# EAGLE design ArduinoInterface (EAGLE 8.3.1)
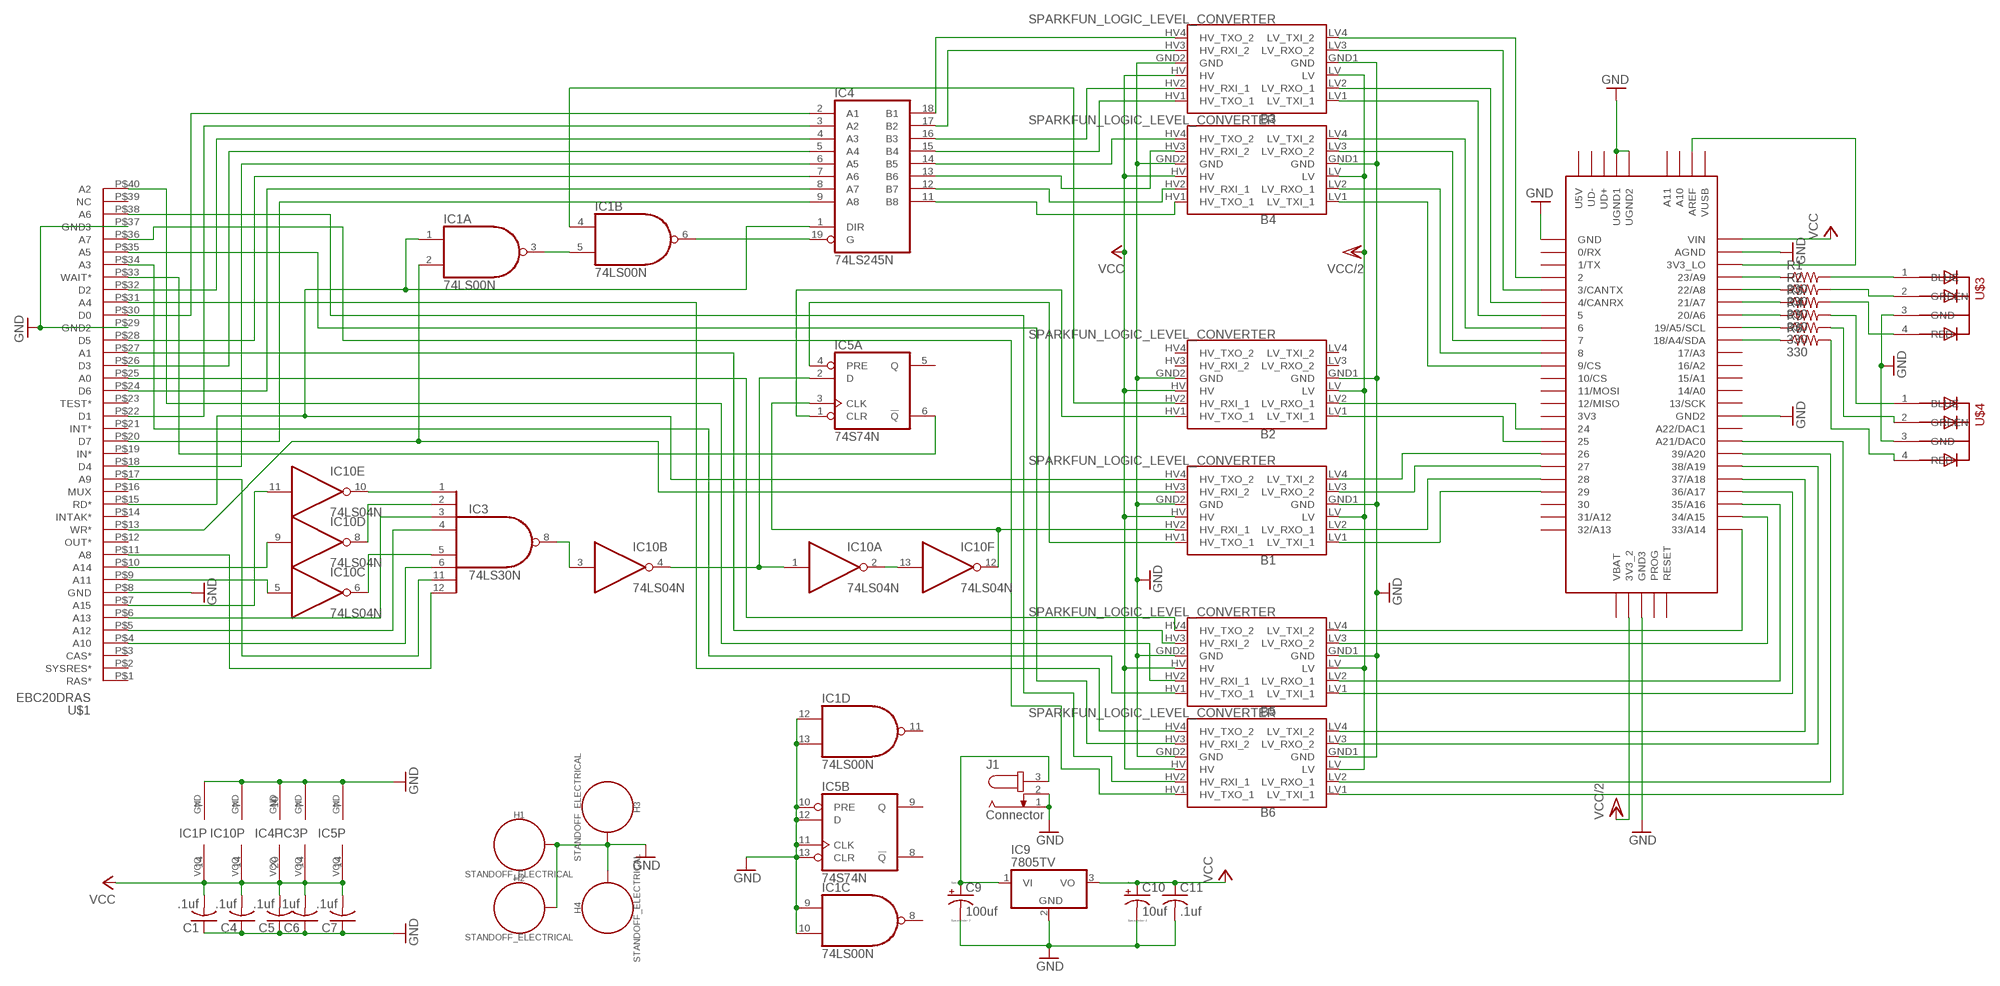
[diagram p0: schematic, sheet 1]

## Parts
B1  SPARKFUN_LOGIC_LEVEL_CONVERTER  [SPARKFUN_LOGIC_LEVEL_CONVERTER]
B2  SPARKFUN_LOGIC_LEVEL_CONVERTER  [SPARKFUN_LOGIC_LEVEL_CONVERTER]
B3  SPARKFUN_LOGIC_LEVEL_CONVERTER  [SPARKFUN_LOGIC_LEVEL_CONVERTER]
B4  SPARKFUN_LOGIC_LEVEL_CONVERTER  [SPARKFUN_LOGIC_LEVEL_CONVERTER]
B5  SPARKFUN_LOGIC_LEVEL_CONVERTER  [SPARKFUN_LOGIC_LEVEL_CONVERTER]
B6  SPARKFUN_LOGIC_LEVEL_CONVERTER  [SPARKFUN_LOGIC_LEVEL_CONVERTER]
C1  .1uf  C-US025-025X050  [C025-025X050]
C4  .1uf  C-US025-025X050  [C025-025X050]
C5  .1uf  C-US025-025X050  [C025-025X050]
C6  .1uf  C-US025-025X050  [C025-025X050]
C7  .1uf  C-US025-025X050  [C025-025X050]
C9  100uf  CPOL-USE5-6  [E5-6]
C10  10uf  CPOL-USE5-6  [E5-6]
C11  .1uf  C-US025-025X050  [C025-025X050]
H1  STANDOFF_ELECTRICAL  [STANDOFF-ELECTRICAL]
H2  STANDOFF_ELECTRICAL  [STANDOFF-ELECTRICAL]
H3  STANDOFF_ELECTRICAL  [STANDOFF-ELECTRICAL]
H4  STANDOFF_ELECTRICAL  [STANDOFF-ELECTRICAL]
IC1  74LS00N  [DIL14]
IC3  74LS30N  [DIL14]
IC4  74LS245N  [DIL20]
IC5  74S74N  [DIL14]
IC9  7805TV  [TO220V]
IC10  74LS04N  [DIL14]
J1  Connector  JACK-PLUG0  [SPC4077]
R1  330  R-US_0204/2V  [0204V]
R2  330  R-US_0204/2V  [0204V]
R3  330  R-US_0204/2V  [0204V]
R4  330  R-US_0204/2V  [0204V]
R5  330  R-US_0204/2V  [0204V]
R6  330  R-US_0204/2V  [0204V]
U$1  EBC20DRAS  [EBC20DRAS]
U$2  TEENSY_3.5/3.6  [TEENSY_3.5/3.6]
U$3  5MMRGBLED  [LED5MMRGB]
U$4  5MMRGBLED  [LED5MMRGB]

## Nets
37XX: IC5.2(A:D) IC10.1(A:I) IC10.4(B:O)
37XX_: IC3.8(O) IC10.3(B:I)
A0: B5.HV4(HV_TXO_2) U$1.P$25(A0)
A0_LV: B5.LV4(LV_TXI_2) U$2.33/A14
A1: B5.HV3(HV_RXI_2) U$1.P$27(A1)
A1_LV: B5.LV3(LV_RXO_2) U$2.34/A15
A2: B5.HV2(HV_RXI_1) U$1.P$40(A2)
A2_LV: B5.LV2(LV_RXO_1) U$2.35/A16
A3: B5.HV1(HV_TXO_1) U$1.P$34(A3)
A3_LV: B5.LV1(LV_TXI_1) U$2.36/A17
A4: B6.HV4(HV_TXO_2) U$1.P$31(A4)
A4_LV: B6.LV4(LV_TXI_2) U$2.37/A18
A5: B6.HV3(HV_RXI_2) U$1.P$35(A5)
A5_LV: B6.LV3(LV_RXO_2) U$2.38/A19
A6: B6.HV2(HV_RXI_1) U$1.P$38(A6)
A6_LV: B6.LV2(LV_RXO_1) U$2.39/A20
A7: B6.HV1(HV_TXO_1) U$1.P$36(A7)
A7_LV: B6.LV1(LV_TXI_1) U$2.21/DAC0(A21/DAC0)
A8: IC3.12(I7) U$1.P$11(A8)
A9: IC3.11(I6) U$1.P$17(A9)
A10: IC3.6(I5) U$1.P$4(A10)
A11: IC10.5(C:I) U$1.P$9(A11)
A12: IC3.4(I3) U$1.P$5(A12)
A13: IC3.3(I2) U$1.P$6(A13)
A15: IC10.11(E:I) U$1.P$7(A15)
D0: IC4.2(A1) U$1.P$30(D0)
D0_HV: B3.HV4(HV_TXO_2) IC4.18(B1)
D0_LV: B3.LV4(LV_TXI_2) U$2.2
D1: IC4.3(A2) U$1.P$22(D1)
D1_HV: B3.HV3(HV_RXI_2) IC4.17(B2)
D1_LV: B3.LV3(LV_RXO_2) U$2.3/CANTX
D2: IC4.4(A3) U$1.P$32(D2)
D2_HV: B3.HV2(HV_RXI_1) IC4.16(B3)
D2_LV: B3.LV2(LV_RXO_1) U$2.4/CANRX
D3: IC4.5(A4) U$1.P$26(D3)
D3_HV: B3.HV1(HV_TXO_1) IC4.15(B4)
D3_LV: B3.LV1(LV_TXI_1) U$2.5
D4: IC4.6(A5) U$1.P$18(D4)
D4_HV: B4.HV4(HV_TXO_2) IC4.14(B5)
D4_LV: B4.LV4(LV_TXI_2) U$2.6
D5: IC4.7(A6) U$1.P$28(D5)
D5_HV: B4.HV3(HV_RXI_2) IC4.13(B6)
D5_LV: B4.LV3(LV_RXO_2) U$2.7
D6: IC4.8(A7) U$1.P$24(D6)
D6_HV: B4.HV2(HV_RXI_1) IC4.12(B7)
D6_LV: B4.LV2(LV_RXO_1) U$2.8
D7: IC4.9(A8) U$1.P$20(D7)
D7_HV: B4.HV1(HV_TXO_1) IC4.11(B8)
D7_LV: B4.LV1(LV_TXI_1) U$2.9/CS
DATA_BUS_ENABLE: B2.HV2(HV_RXI_1) IC1.4(B:I0)
DATA_BUS_ENABLE_LV: B2.LV2(LV_RXO_1) U$2.24
FLIPFLOP_CLR: B2.HV1(HV_TXO_1) IC5.1(A:CLR)
FLIPFLOP_CLR_LV: B2.LV1(LV_TXI_1) U$2.25
FLIPFLOP_PRE: B1.HV1(HV_TXO_1) IC5.4(A:PRE)
FLIPFLOP_PRE_LV: B1.LV1(LV_TXI_1) U$2.29
GND: B1.GND1(GND) B1.GND2(GND) B2.GND1(GND) B2.GND2(GND) B3.GND1(GND) B3.GND2(GND) B4.GND1(GND) B4.GND2(GND) B5.GND1(GND) B5.GND2(GND) B6.GND1(GND) B6.GND2(GND) C1.1 C4.1 C5.1 C6.1 C7.1 C9.- C10.- C11.2 H1.P1 H2.P1 H3.P1 H4.P1 IC1.7(P:GND) IC1.9(C:I0) IC1.10(C:I1) IC1.12(D:I0) IC1.13(D:I1) IC3.7(GND) IC4.10(GND) IC5.7(P:GND) IC5.10(B:PRE) IC5.11(B:CLK) IC5.12(B:D) IC5.13(B:CLR) IC9.2(GND) IC10.7(P:GND) J1.1 J1.2 U$1.P$8(GND) U$1.P$29(GND2) U$1.P$37(GND3) U$2.AGND U$2.GND U$2.GND2 U$2.GND3 U$2.UGND1 U$2.UGND2 U$3.3(GND) U$4.3(GND)
INTERRUPT: B1.HV2(HV_RXI_1) IC5.3(A:CLK) IC10.12(F:O)
INTERRUPT_LV: B1.LV2(LV_RXO_1) U$2.28
N$1: U$2.3V3_LO U$2.AREF
N$2: IC10.9(D:I) U$1.P$10(A14)
N$3: IC3.1(I0) IC10.10(E:O)
N$4: IC3.2(I1) IC10.8(D:O)
N$5: R1.1 U$2.23/A9
N$6: R2.1 U$2.22/A8
N$7: IC10.2(A:O) IC10.13(F:I)
N$8: IC3.5(I4) IC10.6(C:O)
N$9: R3.1 U$2.21/A7
N$10: R1.2 U$3.1(BLUE)
N$11: IC1.6(B:O) IC4.19(G)
N$12: C9.+ IC9.1(VI) J1.3
N$13: IC1.3(A:O) IC1.5(B:I1)
N$14: R2.2 U$3.2(GREEN)
N$15: R3.2 U$3.4(RED)
N$16: R4.1 U$2.20/A6
N$17: R5.1 U$2.19/A5/SCL
N$18: R6.1 U$2.18/A4/SDA
N$19: R4.2 U$4.1(BLUE)
N$20: R5.2 U$4.2(GREEN)
N$21: R6.2 U$4.4(RED)
RD_: B1.HV4(HV_TXO_2) IC1.1(A:I0) IC4.1(DIR) U$1.P$15(RD*)
RD_LV_: B1.LV4(LV_TXI_2) U$2.26
VCC: B1.HV B2.HV B3.HV B4.HV B5.HV B6.HV C1.2 C4.2 C5.2 C6.2 C7.2 C10.+ C11.1 IC1.14(P:VCC) IC3.14(VCC) IC4.20(VCC) IC5.14(P:VCC) IC9.3(VO) IC10.14(P:VCC) U$2.VIN
VCC/2: B1.LV B2.LV B3.LV B4.LV B5.LV B6.LV U$2.3V3_2
WAIT_: IC5.6(A:!Q) U$1.P$33(WAIT*)
WR_: B1.HV3(HV_RXI_2) IC1.2(A:I1) U$1.P$13(WR*)
WR_LV_: B1.LV3(LV_RXO_2) U$2.27
Unconnected: B2.HV3(HV_RXI_2) B2.HV4(HV_TXO_2) B2.LV3(LV_RXO_2) B2.LV4(LV_TXI_2) IC1.8(C:O) IC1.11(D:O) IC5.5(A:Q) IC5.8(B:!Q) IC5.9(B:Q) U$1.P$1(RAS*) U$1.P$2(SYSRES*) U$1.P$3(CAS*) U$1.P$12(OUT*) U$1.P$14(INTAK*) U$1.P$16(MUX) U$1.P$19(IN*) U$1.P$21(INT*) U$1.P$23(TEST*) U$1.P$39(NC) U$2.0/RX U$2.1/TX U$2.3V3 U$2.10/CS U$2.11/MOSI U$2.12/MISO U$2.13/SCK U$2.14/A0 U$2.15/A1 U$2.16/A2 U$2.17/A3 U$2.30 U$2.31/A12 U$2.32/A13 U$2.A10 U$2.A11 U$2.A22/DAC1 U$2.PROG U$2.RESET U$2.U5V U$2.UD+ U$2.UD- U$2.VBAT U$2.VUSB

## Library data of the parts
B1-B6 = SparkFun-Boards:SPARKFUN_LOGIC_LEVEL_CONVERTER: SparkFun Logic Level Converter -Bi-Directional This is the mechnical outline for the 3.3V - 5V bi directional logic level converter. *Note, the "LOCK" Package has the header pins staggered by an offset of 5 mils (off center line), so that when you slide a row of standard 0.1" headers into the PTH pads, it will hold position vertically. See the follwing turorial for more information on this type of special footprints: Sneaky Footprints <https://www.sparkfun.com/tutorials/114> SparkFun Products: SparkFun Logic Level Converter - Bi-Directional <https://www.sparkfun.com/products/12009>
C1 C4-C7 C11 = adafruit:C-US: CAPACITOR, American symbol
C9 C10 = resistor:CPOL-US: POLARIZED CAPACITOR, American symbol
H1-H4 = SparkFun-Hardware:STANDOFF_ELECTRICAL: Stand Off Drill holes with an electrical connection. For example, use these to ground your board to a chassis. Example SparkFun Products Screw - Phillips Head (1/4", 4-40, 10 pack) <https://www.sparkfun.com/products/10453> (PRT-10453) Screw - Phillips Head (1/2", 4-40, 10 pack) <https://www.sparkfun.com/products/10452> (PRT-10452) Screw - Phillips Head (3/4", 4-40, 10 pack) <https://www.sparkfun.com/products/10451> (PRT-10451) Screw - Phillips Head (1", 4-40, 10 pack) <https://www.sparkfun.com/products/10450> (PRT-10450)
IC1 = 74xx-us:74*00: Quad 2-input NAND gate
IC3 = 74xx-us:74*30: 8-input NAND gate
IC4 = 74xx-us:74*245: Octal BUS TRANSCEIVER, 3-state
IC5 = 74xx-us:74*74: Dual D type positive edge triggered FLIP FLOP, preset and clear
IC9 = linear:78*: Positive VOLTAGE REGULATOR Source: http://cache.national.com/ds/LM/LM78L05.pdf http://www.fairchildsemi.com/ds/LM/LM7805.pdf
IC10 = 74xx-us:74*04: Hex INVERTER
J1 = con-jack:JACK-PLUG: DC POWER JACK Power Jack, DC, Right Angle, Through Hole, Rated 5A at 16VDC, PC Terminals Distributor: Farnell (www.Farnell.de) Drawing: 84N1161.pdf / 84N1162.pdf Manufacturer: SPC Technology (www.spctechnology.com) Type: SPC4077 / SPC 4078; OC_FARNELL: unknown; OC_NEWARK: unknown
R1-R6 = resistor:R-US_: RESISTOR, American symbol
U$1 = TMS99:EBC20DRAS
U$2 = Teensy356:TEENSY_3.5/3.6
U$3 U$4 = adafruit:5MMRGBLED

## Net classes
0 default: width 0.3 mm, clearance 0.05 mm

## Board
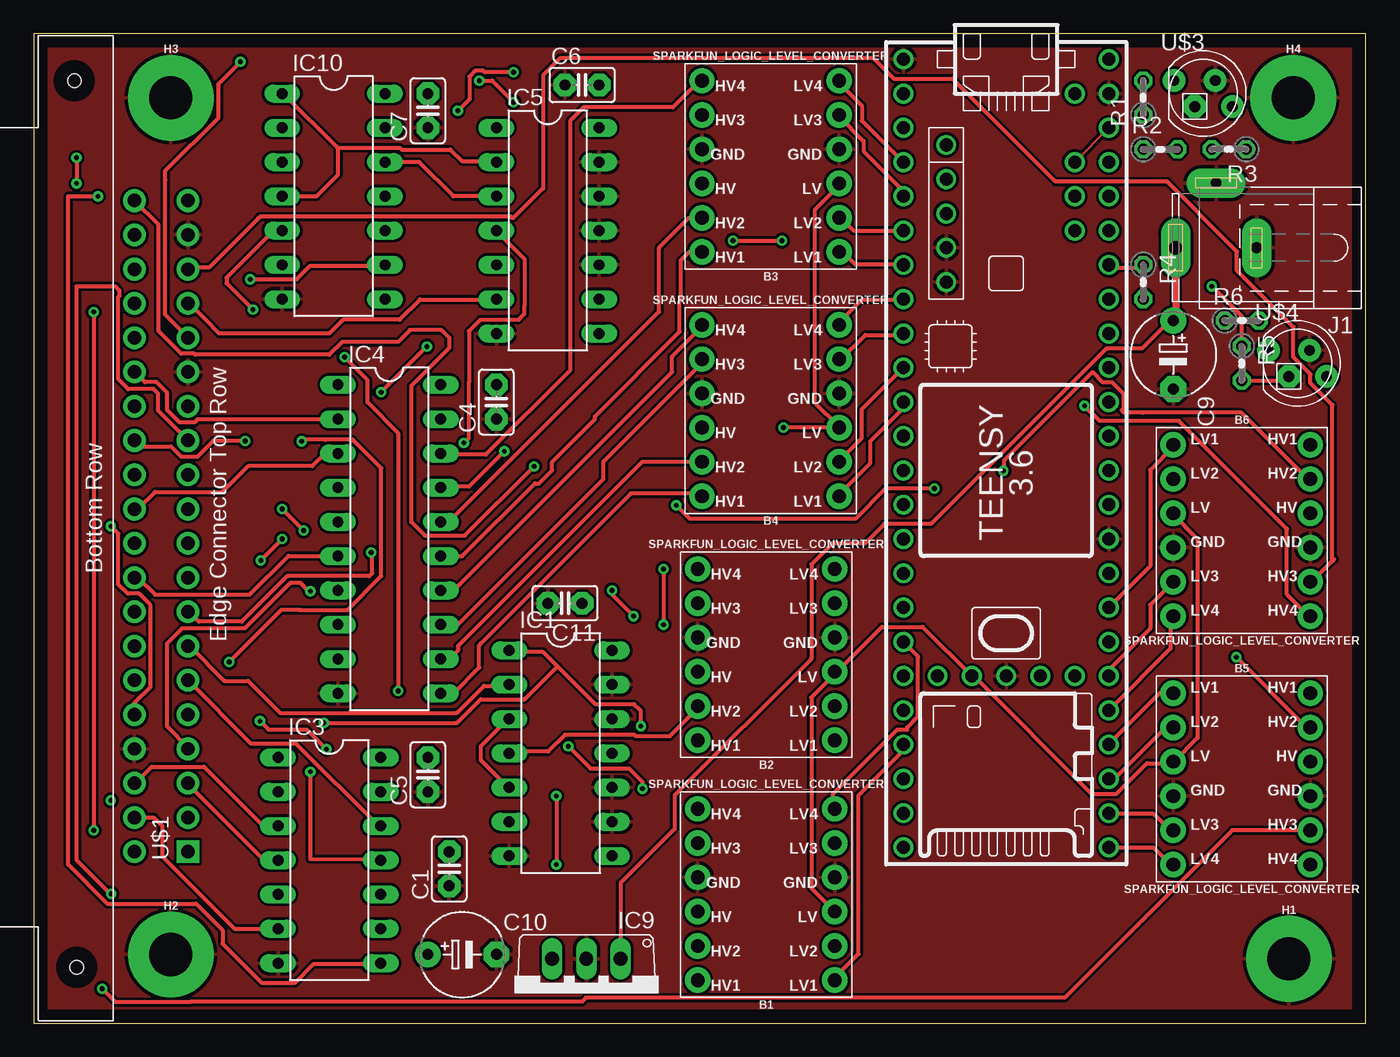
[diagram p1: board, top side]
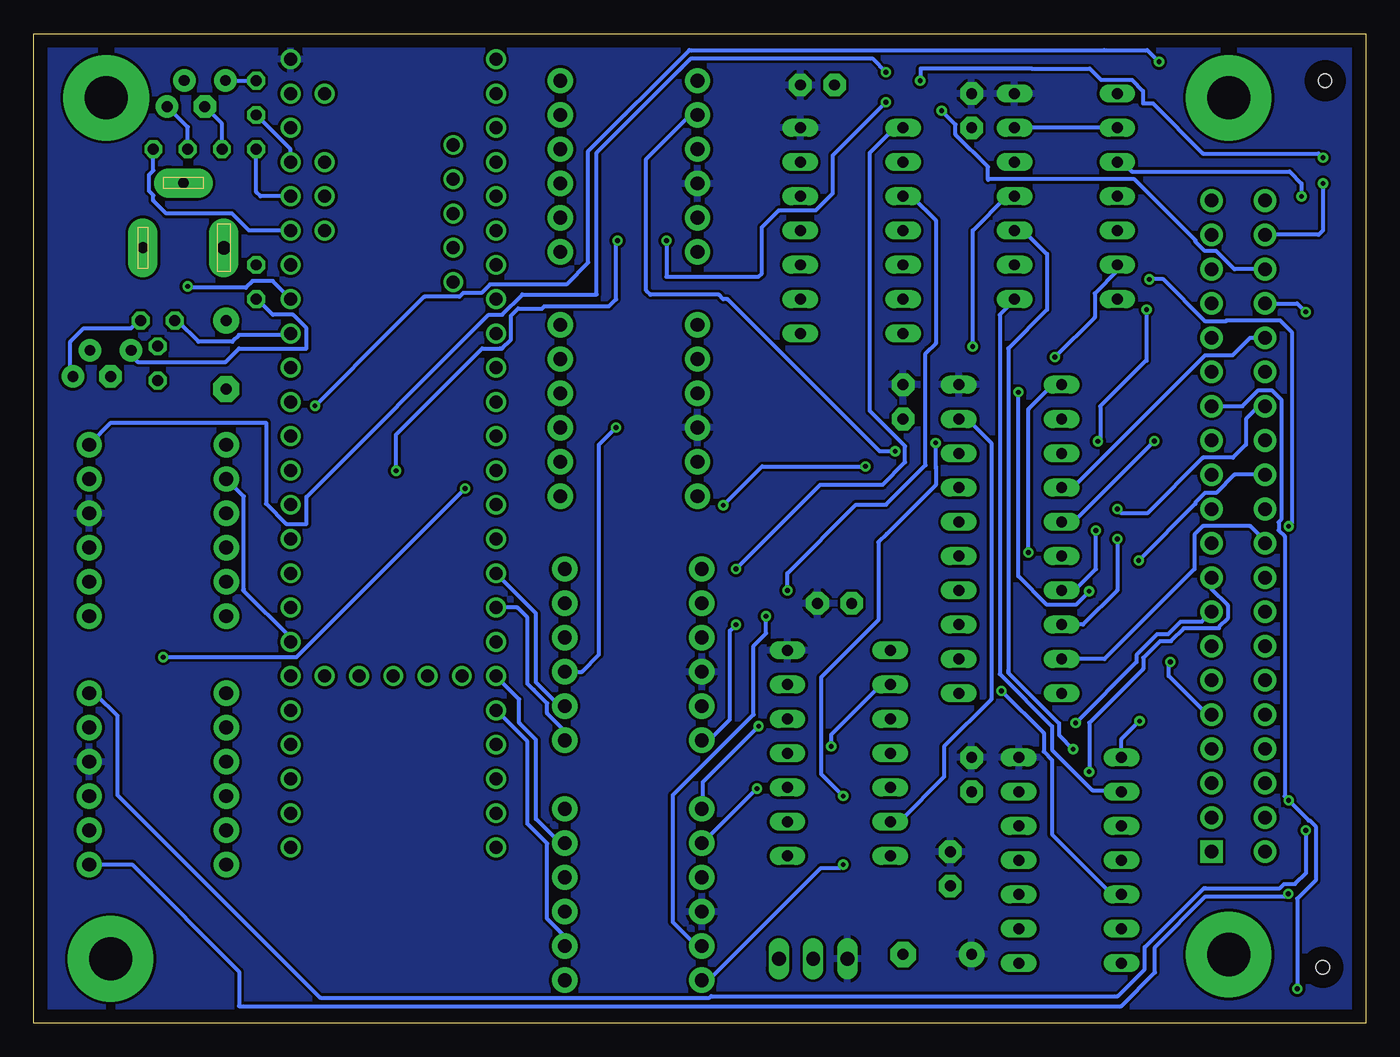
[diagram p2: board, bottom side, seen from below]

Size 98.72 x 73.33 mm. Coordinates in mm from the lower left corner, seen from the top.
Outline: 0,0 98.72,0 98.72,73.33 0,73.33 0,0
Copper layers (1*16): Top 0.035mm / dielectric 1.5mm / Bottom 0.035mm
Design rules "default": minimum track width 0.2mm, minimum drill 0.35mm, track to track 8mil, track to pad 8mil, pad to pad 8mil, via to via 8mil, smd to smd 8mil, copper to edge 40mil, drill to drill 6mil, minimum pad ring 10mil, minimum via ring 8mil, stop-mask expansion 4mil, vias tented up to drill 0mil, thermal gap 10mil

### Footprints (pad centres in the part's own frame; a part is rotated, then mirrored left to right if it is on the bottom)
SPARKFUN_LOGIC_LEVEL_CONVERTER = drill 1.016 pad 1.88: GND1 -5.08,-1.27; GND2 5.08,-1.27; HV 5.08,1.27; HV1 5.08,6.35; HV2 5.08,3.81; HV3 5.08,-3.81; HV4 5.08,-6.35; LV -5.08,1.27; LV1 -5.08,6.35; LV2 -5.08,3.81; LV3 -5.08,-3.81; LV4 -5.08,-6.35
C025-025X050 = drill 0.813 pad 1.676 octagon: 1 -1.27,0; 2 1.27,0
E5-6 = drill 0.813 pad 1.905: + -2.54,0 | drill 0.813 pad 1.905 octagon: - 2.54,0
STANDOFF-ELECTRICAL = drill 3.2 pad 6.35: P1 0,0
DIL14 = drill 0.813 long: 1 -7.62,-3.81; 2 -5.08,-3.81; 3 -2.54,-3.81; 4 0,-3.81; 5 2.54,-3.81; 6 5.08,-3.81; 7 7.62,-3.81; 8 7.62,3.81; 9 5.08,3.81; 10 2.54,3.81; 11 0,3.81; 12 -2.54,3.81; 13 -5.08,3.81; 14 -7.62,3.81
DIL20 = drill 0.813 long: 1 -11.43,-3.81; 2 -8.89,-3.81; 3 -6.35,-3.81; 4 -3.81,-3.81; 5 -1.27,-3.81; 6 1.27,-3.81; 7 3.81,-3.81; 8 6.35,-3.81; 9 8.89,-3.81; 10 11.43,-3.81; 11 11.43,3.81; 12 8.89,3.81; 13 6.35,3.81; 14 3.81,3.81; 15 1.27,3.81; 16 -1.27,3.81; 17 -3.81,3.81; 18 -6.35,3.81; 19 -8.89,3.81; 20 -11.43,3.81
TO220V = drill 1.016 long: 1 -2.54,-2.54; 2 0,-2.54; 3 2.54,-2.54
SPC4077 = drill 0.8 pad 2.184 long: 1 -3,0; 2 0,-4.8 | drill 1 pad 2.184 long: 3 3,0
0204V = drill 0.813 octagon: 1 -1.27,0; 2 1.27,0
EBC20DRAS = drill 1 pad 1.676 square: P$1 0,0 | drill 1 pad 1.676: P$2 0,3.969; P$3 2.54,0; P$4 2.54,3.969; P$5 5.08,0; P$6 5.08,3.969; P$7 7.62,0; P$8 7.62,3.969; P$9 10.16,0; P$10 10.16,3.969; P$11 12.7,0; P$12 12.7,3.969; P$13 15.24,0; P$14 15.24,3.969; P$15 17.78,0; P$16 17.78,3.969; P$17 20.32,0; P$18 20.32,3.969; P$19 22.86,0; P$20 22.86,3.969; P$21 25.4,0; P$22 25.4,3.969; P$23 27.94,0; P$24 27.94,3.969; P$25 30.48,0; P$26 30.48,3.969; P$27 33.02,0; P$28 33.02,3.969; P$29 35.56,0; P$30 35.56,3.969; P$31 38.1,0; P$32 38.1,3.969; P$33 40.64,0; P$34 40.64,3.969; P$35 43.18,0; P$36 43.18,3.969; P$37 45.72,0; P$38 45.72,3.969; P$39 48.26,0; P$40 48.26,3.969 | hole 1: -8.572,8.255; 57.15,8.414
TEENSY_3.5/3.6 = drill 0.965: 0/RX -25.4,-7.62; 1/TX -22.86,-7.62; 2 -20.32,-7.62; 3/CANTX -17.78,-7.62; 3V3 7.62,-7.62; 3V3_2 17.78,-2.54; 3V3_LO -22.86,7.62; 4/CANRX -15.24,-7.62; 5 -12.7,-7.62; 6 -10.16,-7.62; 7 -7.62,-7.62; 8 -5.08,-7.62; 9/CS -2.54,-7.62; 10/CS 0,-7.62; 11/MOSI 2.54,-7.62; 12/MISO 5.08,-7.62; 13/SCK 5.08,7.62; 14/A0 2.54,7.62; 15/A1 0,7.62; 16/A2 -2.54,7.62; 17/A3 -5.08,7.62; 18/A4/SDA -7.62,7.62; 19/A5/SCL -10.16,7.62; 20/A6 -12.7,7.62; 21/A7 -15.24,7.62; 21/DAC0 12.7,7.62; 22/A8 -17.78,7.62; 23/A9 -20.32,7.62; 24 10.16,-7.62; 25 12.7,-7.62; 26 15.24,-7.62; 27 17.78,-7.62; 28 20.32,-7.62; 29 22.86,-7.62; 30 25.4,-7.62; 31/A12 27.94,-7.62; 32/A13 30.48,-7.62; 33/A14 30.48,7.62; 34/A15 27.94,7.62; 35/A16 25.4,7.62; 36/A17 22.86,7.62; 37/A18 20.32,7.62; 38/A19 17.78,7.62; 39/A20 15.24,7.62; A10 -17.78,5.08; A11 -15.24,5.08; A22/DAC1 10.16,7.62; AGND -25.4,7.62; AREF -20.32,5.08; GND -27.94,-7.62; GND2 7.62,7.62; GND3 17.78,0; PROG 17.78,2.54; RESET 17.78,5.08; U5V -21.59,-4.445; UD+ -16.51,-4.445; UD- -19.05,-4.445; UGND1 -13.97,-4.445; UGND2 -11.43,-4.445; VBAT 17.78,-5.08; VIN -27.94,7.62; VUSB -25.4,5.08
LED5MMRGB = drill 0.8 pad 1.676: 1 -2.159,0.968; 3 0.889,0.968; 4 2.159,-0.968 | drill 0.8 pad 1.676 octagon: 2 -0.635,-0.968

### Placement (x,y rotation side)
B1  54.29,9.53 180 top
B2  54.29,27.3 180 top
B3  54.61,63.5 180 top
B4  54.61,45.4 180 top
B5  89.53,18.1 0 top
B6  89.53,36.51 0 top
C1  30.8,11.43 90 top
C4  34.29,46.04 90 top
C5  29.21,18.41 90 top
C6  40.64,69.53 0 top
C7  29.21,67.63 90 top
C9  84.45,49.53 270 top
C10  31.75,5.08 0 top
C11  39.37,31.11 180 top
H1  93.03,4.76 0 top
H2  10.16,5.08 0 top
H3  10.16,68.58 0 top
H4  93.34,68.58 0 top
IC1  39.05,20 270 top
IC3  21.91,12.06 270 top
IC4  26.35,35.88 270 top
IC5  38.1,58.74 270 top
IC9  40.96,2.22 180 top
IC10  22.23,61.28 270 top
J1  87.63,57.47 180 top
R1  82.23,68.58 90 top
R2  83.5,64.77 0 top
R3  88.58,64.77 180 top
R4  82.23,54.93 270 top
R5  89.53,48.9 270 top
R6  89.53,52.07 0 top
U$1  11.43,12.7 90 top
U$2  72.07,43.5 270 top
U$3  86.68,68.9 0 top
U$4  93.66,48.9 0 top

### Tracks (layer width: path | path; a pad name or v marks a point on that pad's centre or on a via)
37XX
  Top 0.3: 22.51,64.88 27.12,64.88 27.25,64.75 30.88,64.75 31.75,63.88 34.25,63.88 IC5.2
  Top 0.305: IC10.4 20.95,61.28 22.54,62.87 22.54,64.84 22.51,64.88 18.49,68.9 IC10.1
37XX_  (via drill 0.35)
  Top 0.3: 12.3,8.57 14,6.88 14,5.88 16.88,3 19.38,3 20.75,4.38 25.62,4.38 IC3.8
  Top 0.305: 12.3,8.57 12.03,8.84 5.45,8.84 2.54,11.75 2.54,61.28 v4.76,61.28
  Bottom 0.305: IC10.3 18.02,63.82 17.32,63.12 5.65,63.12 4.76,62.23 v4.76,61.28
A0  (via drill 0.35)
  Top 0.305: v5.75,9.57 5.67,9.57 3.17,12.06 3.17,54.61 6.03,54.61 6.35,54.29 6.35,53.92 6.27,53.83 6.27,47.72 6.99,46.99 8.89,46.99 9.21,46.67 9.21,45.4 U$1.P$25
  Bottom 0.3: 8,9.38 11.88,9.38 15.62,5.62 15.62,3.75 18.12,1.25 83.5,1.25 | 93.88,11.62 94.5,11.62 B5.HV4
  Bottom 0.305: 8,9.38 5.95,9.38 v5.75,9.57 | B5.HV4 91.44,11.75 83.5,3.81 83.5,1.25
A0_LV
  Top 0.3: U$2.33/A14 79.75,13 83,13 84.38,11.62 B5.LV4
A1  (via drill 0.35)
  Top 0.305: B5.HV3 88.83,14.29 76.42,1.88 40.93,1.88 40.64,1.59 11.66,1.59 11.62,1.55 6.07,1.55 v5.08,2.54
  Bottom 0.3: 11.5,45.62 U$1.P$27
  Bottom 0.305: U$1.P$27 9.15,45.72 7.96,46.91 6.97,46.91 6.27,46.21 6.27,37.31 6.45,37.13 6.45,36.53 6.02,36.1 6.02,16.81 v5.71,16.51 4.23,15.02 4.14,15.02 3.71,14.59 3.71,10.58 5.08,9.21 v5.08,2.54
A1_LV
  Top 0.3: U$2.34/A15 79.75,15.5 83,15.5 84.12,14.38 84.38,14.38 B5.LV3
A2  (via drill 0.35)
  Top 0.3: 29.25,48.5 28,47.25 28,37.12 29,36.12 31.75,36.12 | v47.62,38.38 48.62,37.38 60.88,37.38 63.13,39.62 v66.75,39.62 | v89.12,27.12 94.25,22 94.5,22 B5.HV2
  Top 0.305: 29.25,48.5 30.8,50.05 30.8,50.8 30.22,51.38 27.88,51.38 26.99,50.48 22.86,50.48 21.91,49.53 12,49.53 11.92,49.61 10.94,49.61 9.24,51.3 9.24,59.18 U$1.P$40 | 31.75,36.12 31.94,36.12 v37.08,41.26
  Bottom 0.3: v47.62,38.38 44.74,41.26 | v66.75,39.62 79.25,27.12 v89.12,27.12
  Bottom 0.305: 44.74,41.26 v37.08,41.26
A2_LV
  Top 0.3: U$2.35/A16 79.75,18.12 80.12,18.12 83.88,21.88 84.38,21.88 B5.LV2
A3  (via drill 0.35)
  Top 0.305: v4.45,52.7 v4.45,14.29
  Bottom 0.3: 11.88,10 12,10 16.38,5.62 16.38,4 18.38,2 48.5,2 48.62,1.88 77.47,1.88 | 92.5,16.88 92.5,22.75 94.12,24.38 94.5,24.38 B5.HV1
  Bottom 0.305: U$1.P$34 5.08,53.34 v4.45,52.7 | 11.88,10 6.36,10 6.05,10.31 5.25,10.31 4.45,11.11 v4.45,14.29 | 77.47,1.88 77.5,1.88 92.5,16.88
A3_LV
  Top 0.3: U$2.36/A17 79.75,20.75 83.5,24.5 84.38,24.5 B5.LV1
A4  (via drill 0.35)
  Top 0.3: 9.75,62.5 9.75,52.5 11.38,50.88 U$1.P$31 | v77.88,45.75 79,44.62 84.88,44.62 92.88,36.62 92.88,31.75 94.5,30.12 B6.HV4
  Top 0.305: v15.32,71.25 13.69,69.62 13.69,67.12 9.75,63.18 9.75,62.5
  Bottom 0.3: 19.38,72.12 50.12,72.12 57.62,64.62 57.62,56.38 59.25,54.75 | 72.12,51.5 v77.88,45.75
  Bottom 0.305: 59.25,54.75 64.91,54.75 65.55,54.11 66.9,54.11 67.17,53.84 69.79,53.84 72.12,51.5 | 19.38,72.12 16.2,72.12 v15.32,71.25
A4_LV
  Top 0.3: U$2.37/A18 79.75,23.25 84.25,27.75 84.25,30 84.38,30.12 B6.LV4
A5
  Top 0.3: 16.63,59.63 13,56 11.5,56 U$1.P$35 | 37.75,62.12 37.75,70.25 39,71.5 62.25,71.5 63.75,70 68.11,70 75.73,62.38 84,62.38 88.7,57.67 88.75,57.62 | 96.38,34.38 96.25,34.25 94.62,32.62 B6.HV3
  Top 0.305: 37.75,62.12 37.75,61.88 35.56,59.69 35.44,59.69 35.37,59.75 16.75,59.75 16.63,59.63 | 88.7,57.67 89.18,57.19 89.18,55.78 93.36,51.6 93.36,49.37 94.63,48.1 94.63,47.43 96.25,45.81 96.25,34.25
A5_LV
  Top 0.3: U$2.38/A19 79.75,25.75 79.75,26.25 82.75,29.25 82.75,31 84.38,32.62 B6.LV3
A6  (via drill 0.35)
  Top 0.3: 82.16,45.25 82.23,45.25 89.5,45.25 94.5,40.25 B6.HV2
  Top 0.305: v33.02,69.85 33.97,69.85 v35.56,68.26 | v71.87,40.93 71.94,41 71.94,41.73 78.45,48.23 78.49,48.23 79.24,47.48 79.93,47.48 80.78,46.63 80.78,45.59 80.64,45.45 80.64,45.4 80.8,45.25 82.23,45.25 | v51.83,58 v55.45,58 | v3.17,64.14 v3.17,62.23
  Bottom 0.3: 24.75,70.75 24.77,70.75 33,70.75 | 39.5,64.25 39.5,61.5 40.75,60.25 43.5,60.25 | 60.88,53.12 59.38,53.12 | 65.49,50 64.14,50 64,50
  Bottom 0.305: 33,70.75 33,69.87 v33.02,69.85 | 39.5,64.25 39.5,64.32 v35.56,68.26 | v3.17,62.23 3.17,58.74 3.49,58.42 U$1.P$38 | 24.77,70.75 20.46,70.75 19.63,69.91 17.33,69.91 16.51,69.08 16.51,68.17 15.78,68.17 12.06,64.45 3.49,64.45 v3.17,64.14 | 64.14,50 64.11,50.02 64,50.02 63.36,50.66 63.36,52.42 62.81,52.97 61.03,52.97 60.88,53.12 | v71.87,40.93 71.87,43.61 65.49,50 | 59.38,53.12 56.09,53.12 55.56,53.66 55.56,57.89 v55.45,58 | v51.83,58 51.83,55.32 45.01,55.32 44.77,55.56 44.77,58.98 43.5,60.25
A6_LV
  Bottom 0.3: 79.75,28.38 U$2.39/A20
  Bottom 0.305: U$2.39/A20 79.69,28.57 83.19,32.07 83.19,32.14 83.16,32.17 83.16,39.03 B6.LV2
A7  (via drill 0.35)
  Top 0.305: v31.43,67.63 32.29,68.48 32.29,70.15 32.72,70.58 33.32,70.58 33.42,70.48 v35.56,70.48
  Bottom 0.3: 94.5,42.75 B6.HV1 94.5,43 93,44.5 81.5,44.5 81.5,38.5 80,37 78.5,37 78.5,39 65,52.5 64,52.5 62.5,54 57,54 57,64.5 50,71.5 37.15,71.5 37,71.5 | 7.5,56 U$1.P$36
  Bottom 0.305: v31.43,67.63 30.4,66.6 30.4,65.86 28,63.46 28,62.5 27.95,62.55 17.14,62.55 12.62,58.03 12.62,57.93 11.92,57.23 11.09,57.23 9.74,55.88 U$1.P$36 | 37.15,71.5 36.58,71.5 v35.56,70.48
A7_LV
  Top 0.3: U$2.21/DAC0 79.75,30.88 82.75,33.88 82.75,41 84.5,42.75 B6.LV1
A8
  Top 0.3: 25.62,14.62 IC3.12 | U$1.P$11 11.38,25.38
  Top 0.305: IC3.12 25.56,14.61 19.46,20.7 16.13,20.7 U$1.P$11
A9  (via drill 0.35)
  Top 0.3: v20.5,18.62 20.5,12.17 25.62,12.12 IC3.11
  Bottom 0.3: 20.5,22.25 v20.5,18.62
  Bottom 0.305: 20.5,22.25 16.49,26.26 16.49,27.06 15.24,28.32 14.43,28.32 13.5,29.25 10.88,29.25 10.88,29.35 10.24,29.99 10.24,30.97 11.43,32.17 U$1.P$17
A10
  Top 0.3: 9.55,12.33 14.88,7 18,7 IC3.6
  Top 0.305: U$1.P$4 8.89,15.24 9.53,14.61 9.53,12.35 9.55,12.33
A11  (via drill 0.35)
  Top 0.3: 21.62,43.25 23.62,43.25 25.75,41.12 25.75,33.12 23.25,30.62 19.68,30.62 19.62,30.62
  Top 0.305: IC10.5 17.78,58.74 14.29,55.24 14.29,54.84 v16.25,52.88 | 21.62,43.25 19.99,43.25 v19.86,43.12 | 19.68,30.62 18.36,30.62 v14.49,26.76
  Bottom 0.3: v16.25,52.88 16.25,49.1 | 11.5,22.88 U$1.P$9
  Bottom 0.305: U$1.P$9 11.75,22.86 14.61,25.72 14.61,26.64 v14.49,26.76 | 16.25,49.1 16.3,49.1 19.68,45.72 19.68,43.28 v19.86,43.12
A12
  Top 0.3: IC3.4 18,12.12 17,12.12 11.38,17.75 U$1.P$5
A13
  Top 0.3: IC3.3 18,14.62 17,14.62 12.62,19 8.75,19 7.5,17.75 U$1.P$6
A15  (via drill 0.35)
  Top 0.3: v25.75,46.76 v29.14,50.15 | 11,29.25 9.88,28.12 9.88,22 11.5,20.38 U$1.P$7
  Top 0.305: v20.5,32 20.39,32 19.77,32.62 19,32.62 15.64,29.25 11,29.25
  Bottom 0.3: v29.14,50.15 29.14,58.74 26.62,61.25 26.12,61.25 IC10.11 | v25.75,46.76 25.75,33.12 23.62,31 21.5,31 v20.5,32
D0
  Top 0.3: 12.25,44.75 22.5,44.75 IC4.2 | 7.5,48.25 U$1.P$30
  Top 0.305: 12.25,44.75 12.15,44.75 11.92,44.53 10.8,44.53 9.88,45.44 9.88,46.71 9.1,47.5 8.25,47.5 7.5,48.25
D0_HV
  Top 0.3: 33.5,42.12 39.75,48.38 39.75,66.88 40.75,67.88 47.38,67.88 49.25,69.75 49.5,69.75 B3.HV4
  Top 0.305: 33.5,42.12 30.27,42.12 IC4.18
D0_LV
  Top 0.3: U$2.2 64.38,63.88 61.38,66.88 61.38,68 59.62,69.75 B3.LV4
D1
  Top 0.3: 15.8,41.19 13.98,39.38 9,39.38 7.75,38.12 7.5,38.12 U$1.P$22
  Top 0.305: IC4.3 21.59,42.23 20.64,41.27 15.88,41.27 15.8,41.19
D1_HV  (via drill 0.35)
  Top 0.3: v34.88,42.38 32.25,39.75 30.25,39.75 IC4.17
  Bottom 0.3: 51.62,65.75 50.12,67.25 49.62,67.25 B3.HV3
  Bottom 0.305: 51.62,65.75 53.34,64.03 53.34,54.29 53.02,53.98 47.94,53.98 47.62,53.66 47.31,53.66 36.02,42.38 v34.88,42.38 35.05,42.55
D1_LV
  Top 0.3: U$2.3/CANTX 64.38,61.38 64.38,61.75 61.5,64.62 61.5,65.38 59.62,67.25 B3.LV3
D2
  Bottom 0.3: 10.38,49.5 11.88,49.5 21.62,39.75 22.5,39.75 IC4.4
  Bottom 0.305: 10.38,49.5 9.87,49.5 8.57,50.8 U$1.P$32
D2_HV
  Top 0.3: 46.16,52.53 30.88,37.25 30.25,37.25 IC4.16
  Top 0.305: 46.16,52.53 46.35,52.73 46.35,57.47 48.58,59.69 B3.HV2
D2_LV
  Top 0.3: U$2.4/CANRX 64.38,58.75 60.75,58.75 59.75,59.75 B3.LV2
D3  (via drill 0.35)
  Top 0.305: U$1.P$26 7.53,43.18 7.96,42.74 10.18,42.74 10.94,41.99 12.14,41.99 13.34,43.18 15.64,43.18 v15.67,43.15
  Bottom 0.3: 22.5,37.25 IC4.5
  Bottom 0.305: IC4.5 21.67,37.15 v15.67,43.15
D3_HV
  Top 0.3: 47.88,51.25 47.88,53.5 | 49.5,57.12 B3.HV1
  Top 0.305: B3.HV1 48.58,57.15 47.94,56.52 47.94,53.57 47.88,53.5 | IC4.15 31.75,34.61 37.15,40.01 37.47,40.01 38.42,40.96 38.42,41.59 41.59,44.77 41.59,44.97 47.88,51.25
D3_LV
  Top 0.3: U$2.5 64.38,56.25 60.88,56.25 60,57.12 59.75,57.12 B3.LV1
D4
  Top 0.3: IC4.6 22.5,34.62 18.88,34.62 16,31.75 9,31.75 7.75,33 7.5,33 U$1.P$18
D4_HV
  Top 0.3: 49.5,51.38 49.5,51.58 49.5,51.75 B4.HV4
  Top 0.305: IC4.14 31.11,32.07 47.31,48.26 47.31,49.38 49.5,51.58
D4_LV
  Top 0.3: U$2.6 64.38,53.62 61.38,53.62 59.62,51.88 B4.LV4
D5  (via drill 0.35)
  Top 0.305: v18.41,38.1 v20,36.51
  Bottom 0.3: 21.75,32.12 22.5,32.12 IC4.7
  Bottom 0.305: IC4.7 21.59,32.07 20,33.66 v20,36.51 | U$1.P$28 7.94,45.72 8.89,44.77 8.89,42.86 9.84,41.91 12.06,41.91 16.19,37.78 18.1,37.78 v18.41,38.1
D5_HV
  Top 0.3: 49.5,48.88 49.5,49.12 B4.HV3
  Top 0.305: IC4.13 31.43,29.53 42.23,40.32 42.23,41.6 49.5,48.88
D5_LV
  Top 0.3: U$2.7 64.38,51 61.62,51 59.75,49.12 B4.LV3
D6  (via drill 0.35)
  Top 0.305: v18.41,35.88 v16.83,34.29
  Bottom 0.305: IC4.8 20.95,29.53 18.41,32.07 v18.41,35.88 | v16.83,34.29 12.62,38.49 12.62,38.59 11.92,39.29 11.09,39.29 9.74,40.64 U$1.P$24
D6_HV
  Top 0.305: B4.HV2 45.09,41.59 31.43,27.94 31.43,27.62 30.8,26.99 IC4.12
D6_LV
  Top 0.3: U$2.8 61.38,45.5 61.38,43.38 59.62,41.62 B4.LV2
D7
  Bottom 0.3: IC4.9 22.5,27
  Bottom 0.305: IC4.9 19.37,26.99 12.7,33.66 12.7,36.2 12.06,36.83 8.57,36.83 7.46,35.72 U$1.P$20
D7_HV
  Top 0.3: 33.12,28.12 33.14,28.14 44.25,39.25 49.38,39.25 49.5,39.12 B4.HV1
  Top 0.305: IC4.11 31.11,24.45 33.02,26.35 33.02,28.02 33.14,28.14
D7_LV
  Top 0.3: U$2.9/CS 64.38,46 64.38,45.5 62,43.12 62,41.5 59.62,39.12 B4.LV1
DATA_BUS_ENABLE
  Top 0.3: IC1.4 35.25,20.12 38.12,20.12 39.38,21.38 44.5,21.38 44.62,21.25 47.12,21.25 49.25,23.38 B2.HV2
DATA_BUS_ENABLE_LV
  Bottom 0.3: U$2.24 64.38,33.25 61.5,30.38 61.5,25.25 59.75,23.5 B2.LV2
FLIPFLOP_CLR  (via drill 0.35)
  Top 0.305: v46.67,33.66 v46.67,29.53
  Bottom 0.3: 36.75,45.38 36.75,64.5 35,66.25 34.38,66.25 IC5.1 | 47.12,22.5 48.62,21 49.12,21 B2.HV1
  Bottom 0.305: v46.67,29.53 47.12,29.07 47.12,22.5 | v46.67,33.66 40.44,39.89 35.82,39.89 34.14,41.57 34.14,42.77 36.75,45.38
FLIPFLOP_CLR_LV
  Bottom 0.3: 62.12,25.14 62.12,28.5
  Bottom 0.305: B2.LV1 59.37,21.66 60.67,22.96 60.67,23.7 61.66,24.7 61.68,24.7 62.12,25.14 | 62.12,28.5 62.12,30.06 62.87,30.8 U$2.25
FLIPFLOP_PRE  (via drill 0.35)
  Top 0.3: 36.38,53.17 36.38,56.62 34.38,58.62 IC5.4 | 32.25,47.5 32.25,43.38 v31.88,43
  Top 0.305: v38.73,16.83 v38.73,11.75 | 32.25,51.28 32.25,47.5 | 32.25,51.28 32.25,51.3 | 36.38,53.17 36.38,52.57 35.94,52.13 33.1,52.13 32.25,51.28
  Bottom 0.3: 31.88,41.12 31.88,41.27 v31.88,43 | 40.38,25.62 36.12,29.88 | 40.38,11.5 48.62,3.25 49.12,3.25 B1.HV1
  Bottom 0.305: 40.38,25.62 40.38,18.47 v38.73,16.83 | 40.38,11.5 38.98,11.5 v38.73,11.75 | 36.12,29.88 36.12,35.64 35.5,36.27 35.49,36.27 31.88,39.88 31.88,41.27
FLIPFLOP_PRE_LV
  Top 0.3: U$2.29 64.38,20.62 64.38,20.12 61.12,16.88 61.12,5.12 59.25,3.25 B1.LV1
GND
  pour Top: 0,73.66 0.32,-0.32 97.79,0.32 97.79,73.03
INTERRUPT  (via drill 0.35)
  Top 0.305: v42.86,32.07 42.86,31.75 v44.45,30.16 | IC5.3 31.11,61.28 28.57,63.82 IC10.12
  Bottom 0.3: 45.38,22.88 51.38,16.88 51.38,7.5 49.62,5.75 49.25,5.75 B1.HV2 | 32.62,49.62 31.88,50.38 31.88,59.5 33.62,61.25 34.25,61.25 IC5.3
  Bottom 0.305: 45.38,22.88 45.38,27.97 44.45,28.89 v44.45,30.16 | 32.62,49.62 32.62,41.35 35.56,38.42 37.78,38.42 42.86,33.34 v42.86,32.07
INTERRUPT_LV
  Bottom 0.3: 62.12,14.77 62.12,20.88 64.38,23.12 U$2.28
  Bottom 0.305: 62.12,14.77 60.67,13.31 60.67,7.72 59.37,6.42 B1.LV2
N$1
  Top 0.2: U$2.3V3_LO U$2.AREF
N$2  (via drill 0.35)
  Top 0.3: v16.05,55.12 19.5,55.12 20.5,56.12 26,56.12 IC10.9
  Top 0.305: U$1.P$10 7.46,23.71 8.65,24.91 8.65,30.97 7.8,31.83 6.97,31.83 6.27,32.53 6.27,36.28 v5.71,36.83
  Bottom 0.3: v16.05,55.12 15,55.12 11.88,52 10.38,52 | 7.38,22.75 U$1.P$10
  Bottom 0.305: 10.38,52 10.3,52.07 6.35,52.07 5.5,51.22 5.5,37.05 v5.71,36.83
N$3  (via drill 0.35)
  Top 0.305: v16.77,22.39 17.4,21.75 20.24,21.75 v21.69,20.3
  Bottom 0.3: 26.5,26.12 26.5,50 23.62,52.88 23.62,57 25.25,58.62 26,58.62 IC10.10
  Bottom 0.305: IC3.1 18.1,21.05 v16.77,22.39 | 26.5,26.12 26.5,25.96 22.74,22.21 22.74,21.35 v21.69,20.3
N$4
  Bottom 0.3: IC3.2 18.12,17.25 20.25,17.25 23.25,20.25 23.25,22 27.12,25.88 27.12,52.5 26,53.62 IC10.8
N$5
  Bottom 0.305: U$2.23/A9 79.69,64.77 R1.1
N$6
  Bottom 0.305: U$2.22/A8 81.92,61.28 82.23,61.59 R2.1
N$7
  Bottom 0.3: 18.5,66.38 IC10.2 | 26,66.38 IC10.13
  Bottom 0.305: IC10.2 25.98,66.36 26,66.38
N$8  (via drill 0.35)
  Top 0.3: v27,24.62 27,43.75 24.74,46.01
  Top 0.305: 24.74,46.01 24.74,47.65 v23.04,49.35
  Bottom 0.3: v27,24.62 23.88,21.5 23.88,20.12 23.25,19.5 23.25,14 18.88,9.62 18.12,9.62 IC3.5 | 18.5,56.12 IC10.6
  Bottom 0.305: IC10.6 18.41,55.76 20.09,54.08 20.09,52.3 v23.04,49.35
N$9
  Bottom 0.305: U$2.21/A7 82.76,58.74 84.03,60.01 88.9,60.01 89.85,60.96 89.85,61.35 90.17,61.67 90.17,62.87 89.85,63.19 R3.1
N$10
  Bottom 0.305: U$3.1 82.25,69.87 R1.2
N$11
  Bottom 0.3: IC1.6 35.12,15 34.5,15 31.25,18.25 31.25,20.5 27.75,24 27.75,43 29.5,44.75 30.12,44.75 IC4.19
N$12
  Top 0.3: 57.62,34 57.62,27 47.5,16.88 47.5,14.38 43.5,10.38 43.5,4.88 IC9.1 | 66.5,37 79.5,50 82.12,50 84.12,52 84.38,52 84.43,52.05 C9.+
  Top 0.305: 66.5,37 63.04,37 61.59,35.56 59.19,35.56 57.62,34
  Top 0.508: J1.3 84.63,52.25 84.43,52.05
N$13
  Top 0.3: IC1.5 35.12,17.5 33.12,19.5 33.12,20.5 35.12,22.5 IC1.3
N$14
  Bottom 0.305: R2.2 84.77,66.66 U$3.2
N$15
  Bottom 0.305: R3.2 87.31,66.41 U$3.4
N$16
  Top 0.3: R4.1 82,56 80,56 U$2.20/A6
N$17  (via drill 0.35)
  Top 0.305: R5.1 89.53,52.39 v87.31,54.61
  Bottom 0.3: 83,54.5 82.5,55 81,55 80,54 U$2.19/A5/SCL
  Bottom 0.305: 83,54.5 87.2,54.5 v87.31,54.61
N$18
  Bottom 0.3: R6.1 88,52 86.5,50.5 84,50.5 83.5,51 80,51 U$2.18/A4/SDA
N$19
  Bottom 0.3: R4.2 82,53.5 81,52.5 79.5,52.5 78.5,51.5 78.5,50 83.5,50 84.5,49 91,49 91.5,49.5 U$4.1
N$20
  Top 0.305: R5.2 92.73,47.62 U$4.2
N$21
  Bottom 0.3: R6.2 91,52 91.5,51.5 95,51.5 96,50.5 96,48 U$4.4
RD_  (via drill 0.35)
  Top 0.3: 38.81,26.44 41.62,23.62 44.5,23.62 45,23.12 v45,22 | 38.81,26.44 37.75,27.5 35.25,27.5 IC1.1 | 11.5,30.5 | 38.81,26.44 36.38,24 33.12,24 31.38,22.25 v21.5,22.25
  Top 0.305: v25,34.88 25.08,34.79 25.08,33.34 24.87,33.12 18.8,33.12 15.43,29.76 12.24,29.76 11.5,30.5 11.48,30.48 U$1.P$15
  Bottom 0.3: v45,22 49.12,17.88 49.12,15.88 B1.HV4 | v25,34.88 25,45.5 23.25,47.25 22.62,47.25 IC4.1
  Bottom 0.305: v21.5,22.25 17,26.75 17,27.27 15.45,28.83 14.64,28.83 13.71,29.76 12.15,29.76 U$1.P$15
RD_LV_
  Top 0.3: 64.75,21.75 64,21.75 59.25,17 59.25,15.88 B1.LV4
  Top 0.305: 64.75,21.75 64.75,21.93 65.55,22.73 65.55,27.16 U$2.26
  Bottom 0.3: 64.5,28.25 U$2.26
VCC
  pour Bottom: 0,73.66 98.11,73.66 98.42,0 0,0
VCC/2  (via drill 0.35)
  Top 0.3: B6.LV 84.38,37.75 86.25,35.88 86.25,21.12 84.5,19.38 B5.LV 84.38,19.25 82.5,19.25 80.25,17 78.38,17 69.62,25.75 U$2.3V3_2 65.88,29.38 62.88,29.38 59.62,26.12 59.38,26.12 B2.LV 59.5,26 57.62,24.12 57.62,10 59.25,8.38 B1.LV | B4.LV 59.62,44.25 57.88,46 57.88,60.25 59.75,62.12 B3.LV
  Top 0.305: B4.LV v55.56,44.13
  Bottom 0.3: 59.62,44.12 B4.LV | 59.25,26.12 B2.LV
  Bottom 0.305: v55.56,44.13 56.83,42.86 56.83,27.3 58.1,26.04 B2.LV
WAIT_
  Top 0.3: 27.12,52.12 28.62,53.62 34.25,53.62 IC5.6 | 12.75,52.12 11.5,53.38 U$1.P$33
  Top 0.305: 27.12,52.12 22.91,52.12 21.91,51.12 13.76,51.12 12.75,52.12
WR_  (via drill 0.35)
  Top 0.3: 11.5,28 11.6,27.9 14.12,25.38 15.88,25.38 18.25,23 31.38,23 33.38,25 35.12,25 IC1.2 | v45.12,17.38 45.12,17.88 44.12,18.88 41.25,18.88 v39.62,20.5
  Top 0.305: U$1.P$13 11.56,27.94 11.6,27.9
  Bottom 0.3: v45.12,17.38 49.12,13.38 B1.HV3 | v39.62,20.5 39.62,21.38 36,25 35.25,25 IC1.2
WR_LV_
  Bottom 0.3: U$2.27 64.38,25.62 62.75,24 62.75,22.25 61.5,21 61.5,15.12 59.75,13.38 59.38,13.38 B1.LV3